# EasyEDA Pro project Watchdog.eprj

# Schematic Schematic1
Board Name: Board1; Create Date: 2025-07-15; Page Name: P1; Project Name: Watchdog; Schematic Name: Schematic1; Update Date: 2025-07-22; Company: 嘉立创EDA; Page Size: A4; Version: V1.0
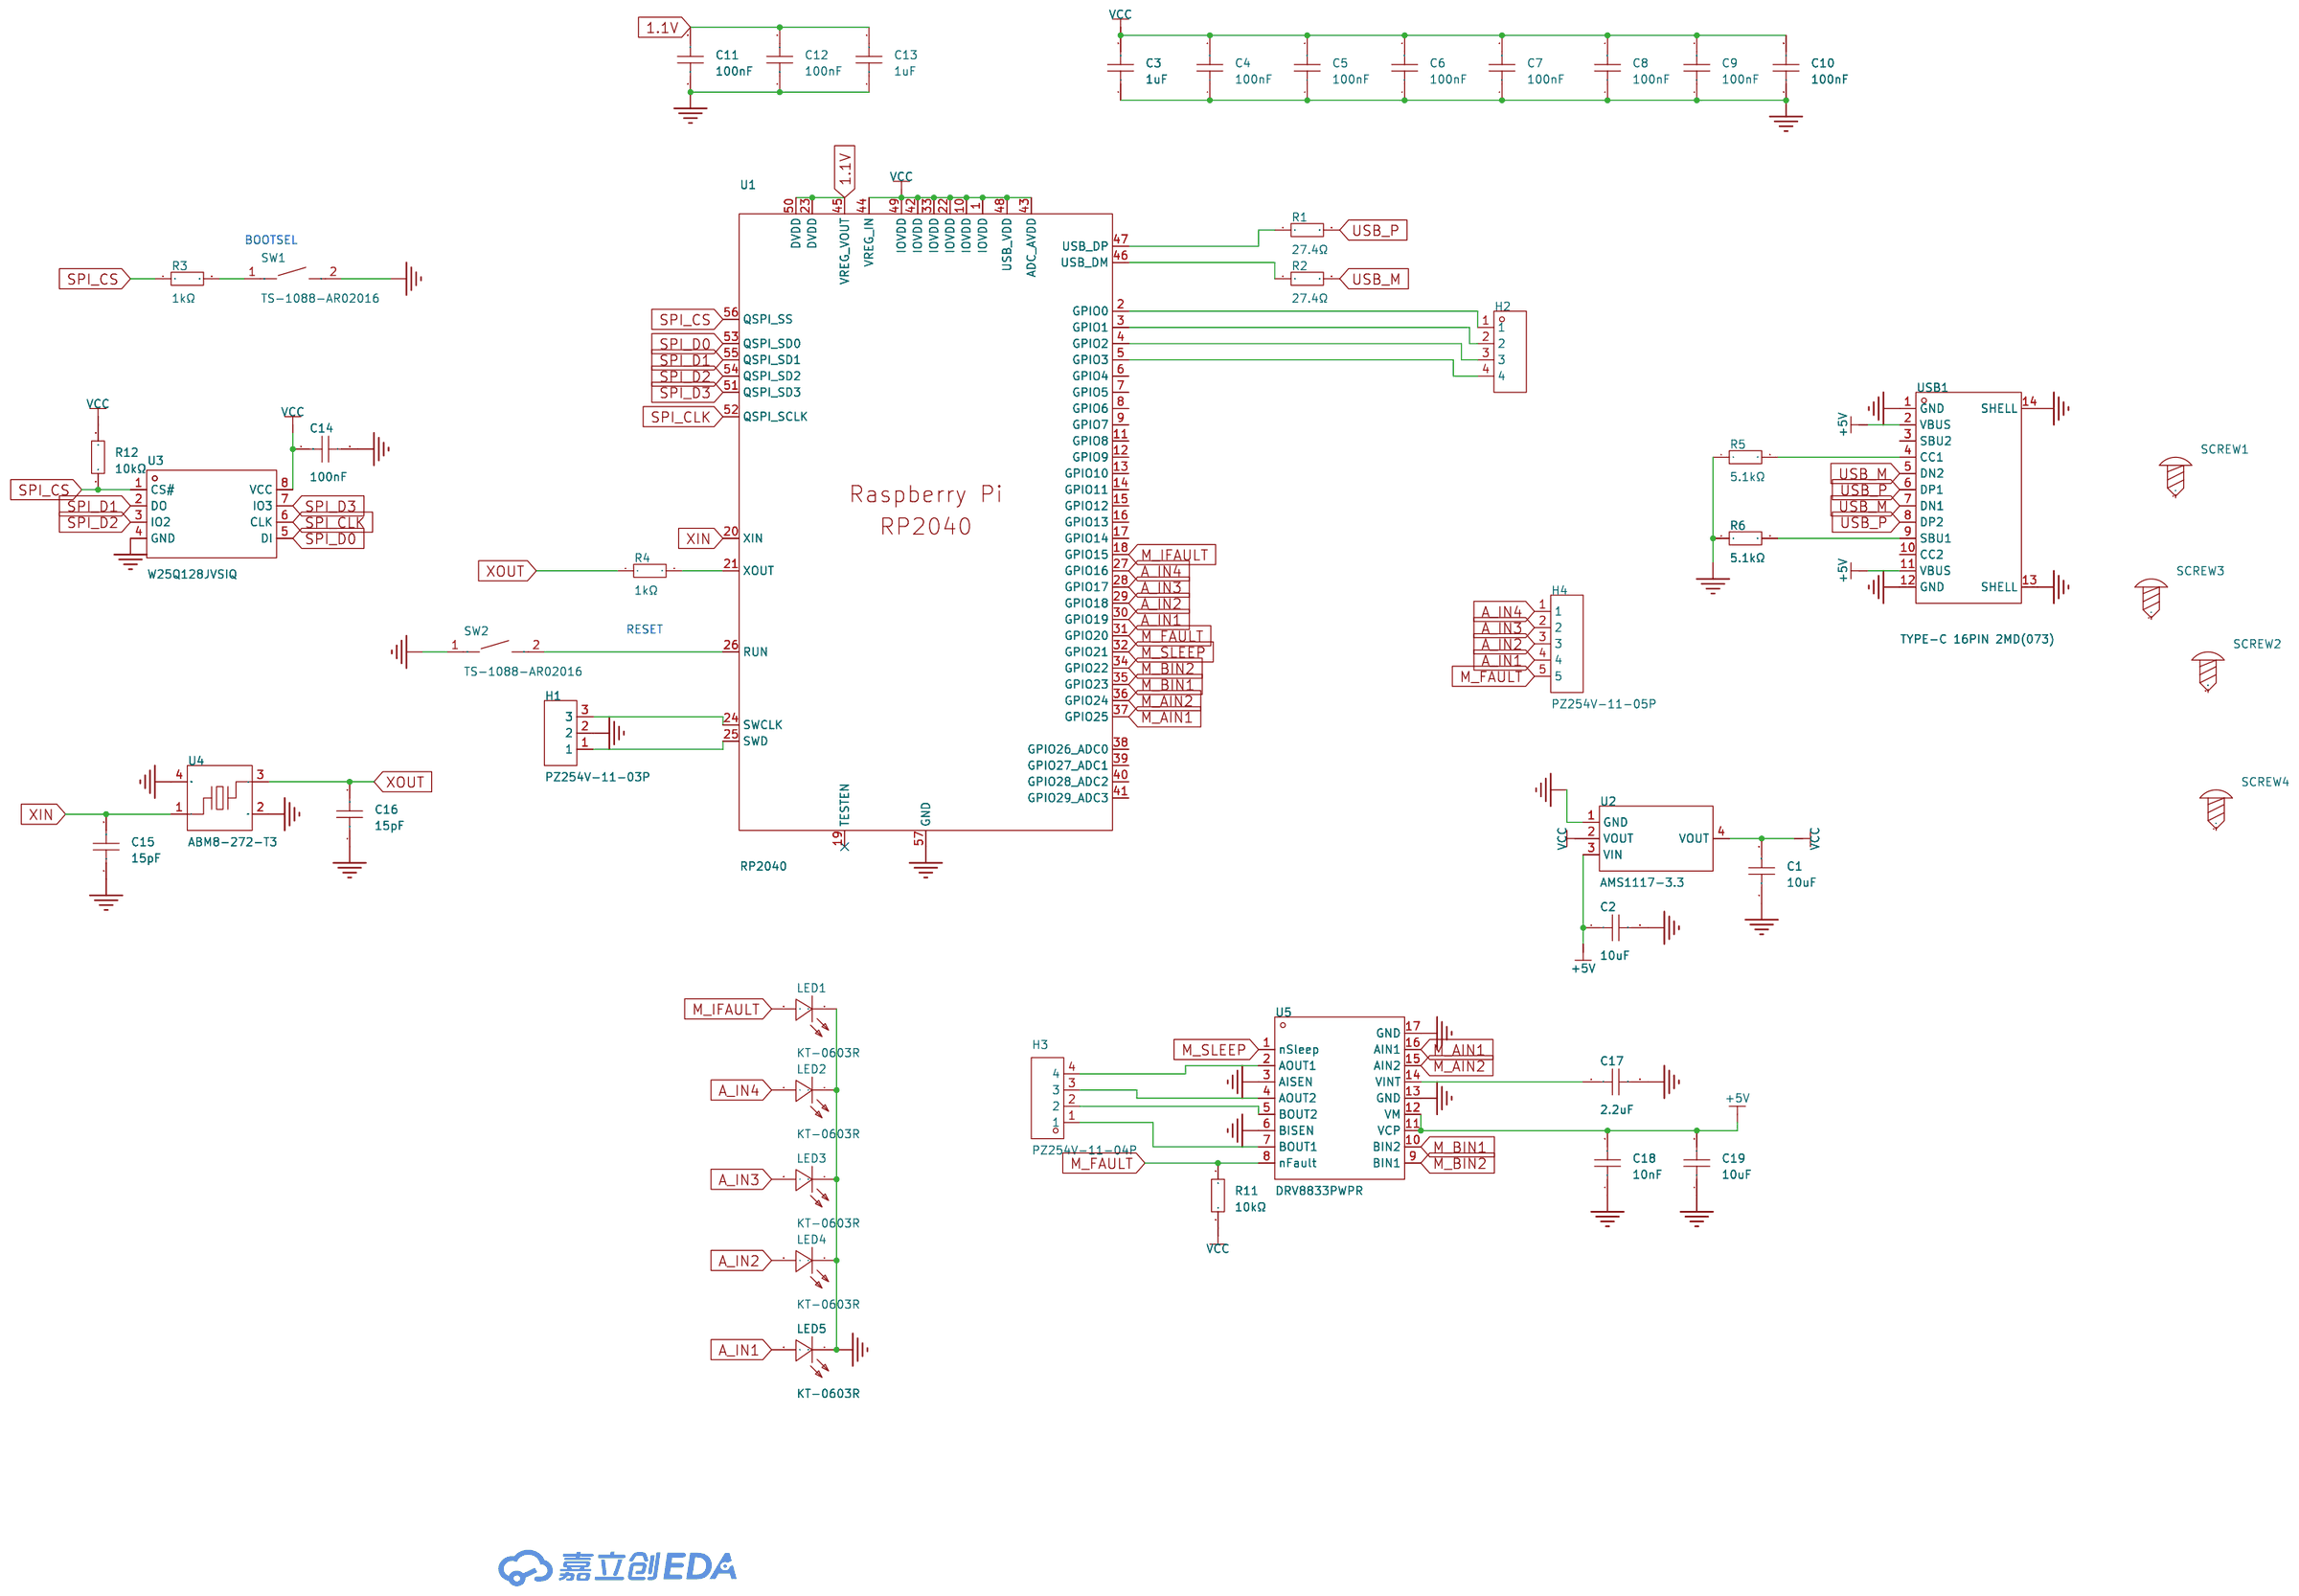
[diagram p0: schematic sheet]

## Parts
C1  10uF  [C0402]
C2  10uF  [C0402]
C3  1uF  [C0402]
C4  100nF  [C0402]
C5  100nF  [C0402]
C6  100nF  [C0402]
C7  100nF  [C0402]
C8  100nF  [C0402]
C9  100nF  [C0402]
C10  100nF  [C0402]
C11  100nF  [C0402]
C12  100nF  [C0402]
C13  1uF  [C0402]
C14  100nF  [C0402]
C15  15pF  [C0402]
C16  15pF  [C0402]
C17  2.2uF  [C0402]
C18  10nF  [C0402]
C19  10uF  [C0402]
H1  PZ254V-11-03P  [HDR-TH_3P-P2.54-V-M]
H2  PZ254V-11-04P  [HDR-TH_4P-P2.54-V-M]
H3  PZ254V-11-04P  [HDR-TH_4P-P2.54-V-M]
H4  PZ254V-11-05P  [HDR-TH_5P-P2.54-V-M]
LED1  KT-0603R  [LED0603-RD]
LED2  KT-0603R  [LED0603-RD]
LED3  KT-0603R  [LED0603-RD]
LED4  KT-0603R  [LED0603-RD]
LED5  KT-0603R  [LED0603-RD]
R1  27.4Ω  [R0402]
R2  27.4Ω  [R0402]
R3  1kΩ  [R0402]
R4  1kΩ  [R0402]
R5  5.1kΩ  [R0402]
R6  5.1kΩ  [R0402]
R11  10kΩ  [R0402]
R12  10kΩ  [R0402]
SCREW1  -  [M3螺丝]
SCREW2  -  [M3螺丝]
SCREW3  -  [M3螺丝]
SCREW4  -  [M3螺丝]
SW1  TS-1088-AR02016  [SW-SMD_L3.9-W3.0-P4.45]
SW2  TS-1088-AR02016  [SW-SMD_L3.9-W3.0-P4.45]
U1  RP2040  [LQFN-56_L7.0-W7.0-P0.4-EP]
U2  AMS1117-3.3  [SOT-223-3_L6.5-W3.4-P2.30-LS7.0-BR]
U3  W25Q128JVSIQ  [SOIC-8_L5.3-W5.3-P1.27-LS8.0-BL]
U4  ABM8-272-T3  [CRYSTAL-SMD_4P-L3.2-W2.5-BL]
U5  DRV8833PWPR  [TSSOP-16_L5.0-W4.4-P0.65-LS6.4-BL-EP]
USB1  TYPE-C 16PIN 2MD(073)  [USB-C-SMD_TYPE-C-6PIN-2MD-073]

## Library data of the parts
C1 C2 C19 = CL05A106MQ5NUNC: LCSC Part Name: 10uF ±20% 6.3V; Supplier Part: C15525; Manufacturer: SAMSUNG(三星); Supplier Footprint: 0402; JLCPCB Part Class: Basic Part; Datasheet: https://atta.szlcsc.com/upload/public/pdf/source/20220823/2B02EE04F8F211D38A52DCB16EB6BEBA.pdf; Supplier: LCSC; Tolerance: ±20%; Voltage Rated: 6.3V; Temperature Coefficient: X5R
C3 C13 = CL05A105KA5NQNC: LCSC Part Name: 1uF ±10% 25V; Supplier Part: C52923; Manufacturer: SAMSUNG(三星); Supplier Footprint: 0402; JLCPCB Part Class: Basic Part; Datasheet: https://atta.szlcsc.com/upload/public/pdf/source/20160218/1457707763339.pdf; Supplier: LCSC; Tolerance: ±10%; Voltage Rated: 25V; Temperature Coefficient: X5R
C4-C12 C14 = CL05B104KB54PNC: LCSC Part Name: 100nF ±10% 50V; Supplier Part: C307331; Manufacturer: SAMSUNG(三星); Supplier Footprint: 0402; JLCPCB Part Class: Basic Part; Datasheet: https://atta.szlcsc.com/upload/public/pdf/source/20160218/1457707763339.pdf; Supplier: LCSC; Tolerance: ±10%; Voltage Rated: 50V; Temperature Coefficient: X7R
C15 C16 = 0402CG150J500NT: LCSC Part Name: 15pF ±5% 50V; Supplier Part: C1548; Manufacturer: FH(风华); Supplier Footprint: 0402; JLCPCB Part Class: Basic Part; Datasheet: https://atta.szlcsc.com/upload/public/pdf/source/20200305/C486355_26A10D38EF8C2A5C37091D0039909270.pdf; Supplier: LCSC; Tolerance: ±5%; Voltage Rated: 50V; Temperature Coefficient: C0G
C17 = CL05A225MQ5NSNC: LCSC Part Name: 2.2uF ±20% 6.3V; Supplier Part: C12530; Manufacturer: SAMSUNG(三星); Supplier Footprint: 0402; JLCPCB Part Class: Basic Part; Datasheet: https://atta.szlcsc.com/upload/public/pdf/source/20160218/1457707763339.pdf; Supplier: LCSC; Tolerance: ±20%; Voltage Rated: 6.3V; Temperature Coefficient: X5R
C18 = CL05B103KB5NNNC: LCSC Part Name: 10nF ±10% 50V; Supplier Part: C15195; Manufacturer: SAMSUNG(三星); Supplier Footprint: 0402; JLCPCB Part Class: Basic Part; Datasheet: https://atta.szlcsc.com/upload/public/pdf/source/20160218/1457707763339.pdf; Supplier: LCSC; Tolerance: ±10%; Voltage Rated: 50V; Temperature Coefficient: X7R
H1 = PZ254V-11-03P: LCSC Part Name: 1x3P 间距:2.54mm 方针 直插; Supplier Part: C2937625; Manufacturer: XFCN(兴飞); Supplier Footprint: 插件,P=2.54mm; JLCPCB Part Class: 扩展库; Datasheet: https://atta.szlcsc.com/upload/public/pdf/source/20200309/C492402_8335C3D49C4E4C618838D59BB1D024C1.pdf; Supplier: LCSC; Pin Structure: 1x3P; Pitch: 2.54mm; Circluar Pins/Square Pins: 方针; Mounting Type: 直插; Number of Rows: 单排; Number of Pins: 3P; Current Rating: 3A; Voltage Rating (Max): 250V; Length of Mating Pin: 6mm; Insulation Height: 2.5mm; Length of End Connection Pin: 3mm; Operating Temperature: -40℃~+105℃; Color: 黑色
H2 H3 = PZ254V-11-04P: LCSC Part Name: 间距:2.54mm 1x4P 直插 方针; Supplier Part: C2691448; Manufacturer: XFCN(兴飞); Supplier Footprint: 插件,P=2.54mm; JLCPCB Part Class: 扩展库; Datasheet: https://atta.szlcsc.com/upload/public/pdf/source/20200309/C492403_F9F19131791D08044AD4F84F8E751A34.pdf; Supplier: LCSC; Pin Structure: 1x4P; Pitch: 2.54mm; Circluar Pins/Square Pins: 方针; Mounting Type: 直插; Number of Rows: 单排; Number of Pins: 4P; Current Rating (Max): 3A; Voltage Rating (Max): 250V; Length of Mating Pin: 6mm; Insulation Height: 2.5mm; Length of End Connection Pin: 3mm; Operating Temperature Range: -40℃~+105℃; Color: 黑色
H4 = PZ254V-11-05P: LCSC Part Name: 1x5P 间距:2.54mm 方针 直插; Supplier Part: C492404; Manufacturer: XFCN(兴飞); Supplier Footprint: 插件,P=2.54mm; JLCPCB Part Class: 扩展库; Datasheet: https://atta.szlcsc.com/upload/public/pdf/source/20200309/C492404_E51533260F8710EFF5D4617281164C1D.pdf; Supplier: LCSC; Pin Structure: 1x5P; Pitch: 2.54mm; Circluar Pins/Square Pins: 方针; Mounting Type: 直插; Number of Rows: 单排; Number of Pins: 5P; Length of Mating Pin: 6mm; Insulation Height: 2.5mm; Length of End Connection Pin: 3mm; Contact Material: 黄铜; Operating Temperature: -40℃~+105℃; Color: 黑色
LED1-LED5 = KT-0603R: LCSC Part Name: 0603 红灯 高亮; Supplier Part: C2286; Manufacturer: KENTO; Supplier Footprint: 0603; JLCPCB Part Class: 基础库; Datasheet: https://atta.szlcsc.com/upload/public/pdf/source/20160616/1466072038404.pdf; Supplier: LCSC; Emitted Color: 红色; Operating Temperature: -40℃~+85℃
R1 R2 = WR04X27R4FTL: LCSC Part Name: 厚膜电阻 27.4Ω ±1% 62.5mW; Supplier Part: C172043; Manufacturer: Walsin(华新科); Supplier Footprint: 0402; JLCPCB Part Class: Extended Part; Datasheet: https://atta.szlcsc.com/upload/public/pdf/source/20191217/C470037_D99261402F77DA8B1D609223749D445A.pdf; Supplier: LCSC; Type: 厚膜电阻; Tolerance: ±1%; Power(Watts): 62.5mW; Overload Voltage (Max): 50V; Temperature Coefficient: ±100ppm/℃; Operating Temperature Range: -55℃~+155℃
R3 R4 = 0402WGF1001TCE: LCSC Part Name: 1kΩ ±1% 62.5mW 厚膜电阻; Supplier Part: C11702; Manufacturer: UNI-ROYAL(厚声); Supplier Footprint: 0402; JLCPCB Part Class: Basic Part; Datasheet: https://atta.szlcsc.com/upload/public/pdf/source/20200306/C422600_1E6D84923E4A46A82E41ADD87F860B5C.pdf; Supplier: LCSC; Type: 厚膜电阻; Tolerance: ±1%; Power(Watts): 62.5mW; Overload Voltage (Max): 50V; Temperature Coefficient: ±100ppm/℃; Operating Temperature Range: -55℃~+155℃
R5 R6 = 0402WGF5101TCE: LCSC Part Name: 5.1kΩ ±1% 62.5mW 厚膜电阻; Supplier Part: C25905; Manufacturer: UNI-ROYAL(厚声); Supplier Footprint: 0402; JLCPCB Part Class: Basic Part; Datasheet: https://atta.szlcsc.com/upload/public/pdf/source/20200306/C422600_1E6D84923E4A46A82E41ADD87F860B5C.pdf; Supplier: LCSC; Type: 厚膜电阻; Tolerance: ±1%; Power(Watts): 62.5mW; Overload Voltage (Max): 50V; Temperature Coefficient: ±100ppm/℃; Operating Temperature Range: -55℃~+155℃
R11 R12 = 0402WGF1002TCE: LCSC Part Name: 10kΩ ±1% 62.5mW 厚膜电阻; Supplier Part: C25744; Manufacturer: UNI-ROYAL(厚声); Supplier Footprint: 0402; JLCPCB Part Class: Basic Part; Datasheet: https://atta.szlcsc.com/upload/public/pdf/source/20200306/C422600_1E6D84923E4A46A82E41ADD87F860B5C.pdf; Supplier: LCSC; Type: 厚膜电阻; Tolerance: ±1%; Power(Watts): 62.5mW; Overload Voltage (Max): 50V; Temperature Coefficient: ±100ppm/℃; Operating Temperature Range: -55℃~+155℃
SCREW1-SCREW4 = M3螺丝: Supplier Footprint: 插件
SW1 SW2 = TS-1088-AR02016: 电路结构:单刀单掷;按钮形状:圆形按钮;作用力:160gf;安装方式:立贴;开关长度:4mm;开关宽度:3mm;开关高度:2mm;带支架:不带;触点电流:50mA;额定电压(DC):12V;绝缘电阻:100MΩ;机械寿命:10万次;; LCSC Part Name: 4*3*2mm 立贴 轻触开关; Supplier Part: C720477; Manufacturer: XUNPU(讯普); Supplier Footprint: SMD; JLCPCB Part Class: 扩展库; Datasheet: https://atta.szlcsc.com/upload/public/pdf/source/20200810/C720475_60D09DD6C54279ADDB2DC25100F1CC11.pdf; Supplier: LCSC; Circuit: 单刀单掷; Actuator Style: 圆形按钮; Operating Force: 160gf; Mounting Style: 立贴; Switch Length: 4mm; Switch Width: 3mm; Switch Height: 2mm; Strike Gundam: 不带; Contact Current: 50mA; Voltage Rating (DC): 12V; Insulation Resistance: 100MΩ; Actuator/Cap Color: 黑色; Pin Style: SMD接片; Mechanical Life: 10万次; Operating Temperature: -30℃~+80℃
U1 = RP2040_C2040: CPU内核:-;CPU最大主频:133MHz;应用领域:-;; LCSC Part Name: RP2040（RP2B2）; Supplier Part: C2040; Manufacturer: Raspberry Pi(树莓派); Supplier Footprint: LQFN-56(7x7); JLCPCB Part Class: 扩展库; Datasheet: https://atta.szlcsc.com/upload/public/pdf/source/20210621/C2040_96F425825606B7957D87DD32E2512CA9.pdf; Supplier: LCSC; CPU Maximum Speed: 133MHz; Number of I/O: 30; ADC (Bit): 12bit
U2 = AMS1117-3.3_C6186: LCSC Part Name: 输出3.3V 1A; Supplier Part: C6186; Manufacturer: AMS; Supplier Footprint: SOT-223; JLCPCB Part Class: 基础库; Datasheet: https://atta.szlcsc.com/upload/public/pdf/source/20180727/C6186_7A095716F0823C02F1997A905E26C086.pdf; Supplier: LCSC; Output Type: 固定; Voltage - Supply: 16V; Output Voltage: 3.3V; Output Current: 1A; Power Supply Rejection Ratio (PSRR): 72dB@(120Hz); Voltage Dropout: 1.1V@(800mA); standby current: 5mA; Features: 过流保护；过热保护; Operating Temperature: -40℃~+125℃; Output Configuration: 正极; Number of Outputs: 1
U3 = W25Q128JVSIQ: LCSC Part Name: W25Q128JVSIQ 编带; Supplier Part: C97521; Manufacturer: WINBOND(华邦); Supplier Footprint: SOIC-8-208mil; JLCPCB Part Class: 基础库; Datasheet: https://atta.szlcsc.com/upload/public/pdf/source/20170316/1489627409956.pdf; Supplier: LCSC; Interface Type: SPI; Memory Size: 128Mbit; Clock Frequency (fc): 133MHz; Supply Voltage: 2.7V~3.6V; Page Programming Time (Tpp): 700us; Block Erase Time (tBE): 120ms@(32KB); Data Retention - TDR (Year): 20年; Operating Temperature: -40℃~+85℃
U4 = ABM8-272-T3_C20625731: 推荐配套使用产品C20625731    ABM8-272-T3 与 C2040   RP2040; Supplier Part: C20625731; Manufacturer: ABRACON; Supplier Footprint: SMD3225-4P; JLCPCB Part Class: 扩展库; Datasheet: https://atta.szlcsc.com/upload/public/pdf/source/20240227/A8BE43F636D80F75C9AF5C59EDF21E9A.pdf; Supplier: LCSC
U5 = DRV8833PWPR: LCSC Part Name: 1.5A 有刷直流电机驱动芯片 10.8V; Supplier Part: C50506; Manufacturer: TI(德州仪器); Supplier Footprint: TSSOP-16-EP; JLCPCB Part Class: 扩展库; Datasheet: https://www.ti.com/cn/lit/gpn/drv8833; Supplier: LCSC; Technology: 是; Operating Temperature: -40℃~+85℃
USB1 = TYPE-C 16PIN 2MD(073): 连接器类型:Type-C;标准:USB 3.1;公母:母;安装方式:卧贴;触点数量:16P;端口数量:1;额定电流 - 电源:5A;工作温度范围:-25℃~+85℃;; LCSC Part Name: Type-C 母 卧贴; Supplier Part: C2765186; Manufacturer: SHOU HAN(首韩); Supplier Footprint: SMD; JLCPCB Part Class: 扩展库; Datasheet: https://atta.szlcsc.com/upload/public/pdf/source/20211123/39B17C16241EAC15C5E277BDA434118E.pdf; Supplier: LCSC; Connector Type: Type-C; Standard: USB 3.1; Gender: 母; Mounting Style: 卧贴; Number of Contacts: 16P; Number of Ports: 1; Current Rating - Power (Max): 5A; Operating Temperature Range: -25℃~+85℃; Rated Voltage (Max): 5V; Connect-Disconnect Life: 5千次; Core Colour: 黑色

## Nets
1.1V: C11.2 C12.2 C13.2 U1.23(DVDD) U1.45(VREG_VOUT) U1.50(DVDD)
+5V: C2.1 C18.2 C19.2 U2.3(VIN) U5.11(VCP) U5.12(VM) USB1.2(VBUS) USB1.11(VBUS)
GND: C1.1 C2.2 C3.1 C4.1 C5.1 C6.1 C7.1 C8.1 C9.1 C10.1 C11.1 C12.1 C13.1 C14.2 C15.1 C16.1 C17.2 C18.1 C19.1 H1.2 LED1.1(K) LED2.1(K) LED3.1(K) LED4.1(K) LED5.1(K) R5.1 R6.1 SW1.2 SW2.1 U1.57(GND) U2.1(GND) U3.4(GND) U4.2(GND) U4.4(GND) U5.3(AISEN) U5.6(BISEN) U5.13(GND) U5.17(GND) USB1.1(GND) USB1.12(GND) USB1.13(SHELL) USB1.14(SHELL)
VCC: C1.2 C3.2 C4.2 C5.2 C6.2 C7.2 C8.2 C9.2 C10.2 C14.1 R11.1 R12.2 U1.1(IOVDD) U1.10(IOVDD) U1.22(IOVDD) U1.33(IOVDD) U1.42(IOVDD) U1.43(ADC_AVDD) U1.44(VREG_IN) U1.48(USB_VDD) U1.49(IOVDD) U2.2(VOUT) U2.4(VOUT) U3.8(VCC)
A_IN1: H4.4 LED5.2(A) U1.30(GPIO19)
A_IN2: H4.3 LED4.2(A) U1.29(GPIO18)
A_IN3: H4.2 LED3.2(A) U1.28(GPIO17)
A_IN4: H4.1 LED2.2(A) U1.27(GPIO16)
M_AIN1: U1.37(GPIO25) U5.16(AIN1)
M_AIN2: U1.36(GPIO24) U5.15(AIN2)
M_BIN1: U1.35(GPIO23) U5.10(BIN2)
M_BIN2: U1.34(GPIO22) U5.9(BIN1)
M_FAULT: H4.5 R11.2 U1.31(GPIO20) U5.8(nFault)
M_IFAULT: LED1.2(A) U1.18(GPIO15)
M_SLEEP: U1.32(GPIO21) U5.1(nSleep)
SPI_CLK: U1.52(QSPI_SCLK) U3.6(CLK)
SPI_CS: R3.1 R12.1 U1.56(QSPI_SS) U3.1(CS#)
SPI_D0: U1.53(QSPI_SD0) U3.5(DI)
SPI_D1: U1.55(QSPI_SD1) U3.2(DO)
SPI_D2: U1.54(QSPI_SD2) U3.3(IO2)
SPI_D3: U1.51(QSPI_SD3) U3.7(IO3)
USB_M: R2.2 USB1.5(DN2) USB1.7(DN1)
USB_P: R1.2 USB1.6(DP1) USB1.8(DP2)
XIN: C15.2 U1.20(XIN) U4.1
XOUT: C16.2 R4.1 U4.3
$1N13068: R1.1 U1.47(USB_DP)
$1N13076: R2.1 U1.46(USB_DM)
$1N13738: R3.2 SW1.1
$1N14583: R5.2 USB1.4(CC1)
$1N14587: R6.2 USB1.9(SBU1)
$1N14734: SW2.2 U1.26(RUN)
$1N14865: H1.3 U1.24(SWCLK)
$1N14870: H1.1 U1.25(SWD)
$1N15181: H2.1 U1.2(GPIO0)
$1N15186: H2.2 U1.3(GPIO1)
$1N15192: H2.3 U1.4(GPIO2)
$1N15202: H2.4 U1.5(GPIO3)
$1N15895: H3.4 U5.2(AOUT1)
$1N15901: H3.3 U5.4(AOUT2)
$1N15907: H3.2 U5.5(BOUT2)
$1N15913: H3.1 U5.7(BOUT1)
$1N15988: C17.1 U5.14(VINT)
$1N24654: R4.2 U1.21(XOUT)

Not connected (* = marked no-connect by the designer): SCREW1 1; SCREW2 1; SCREW3 1; SCREW4 1; U1 6(GPIO4) 7(GPIO5) 8(GPIO6) 9(GPIO7) 11(GPIO8) 12(GPIO9) 13(GPIO10) 14(GPIO11) 15(GPIO12) 16(GPIO13) 17(GPIO14) 19(TESTEN)* 38(GPIO26_ADC0) 39(GPIO27_ADC1) 40(GPIO28_ADC2) 41(GPIO29_ADC3); USB1 3(SBU2) 10(CC2)

## Notes on the sheet
- BOOTSEL
- RESET

# Board PCB1
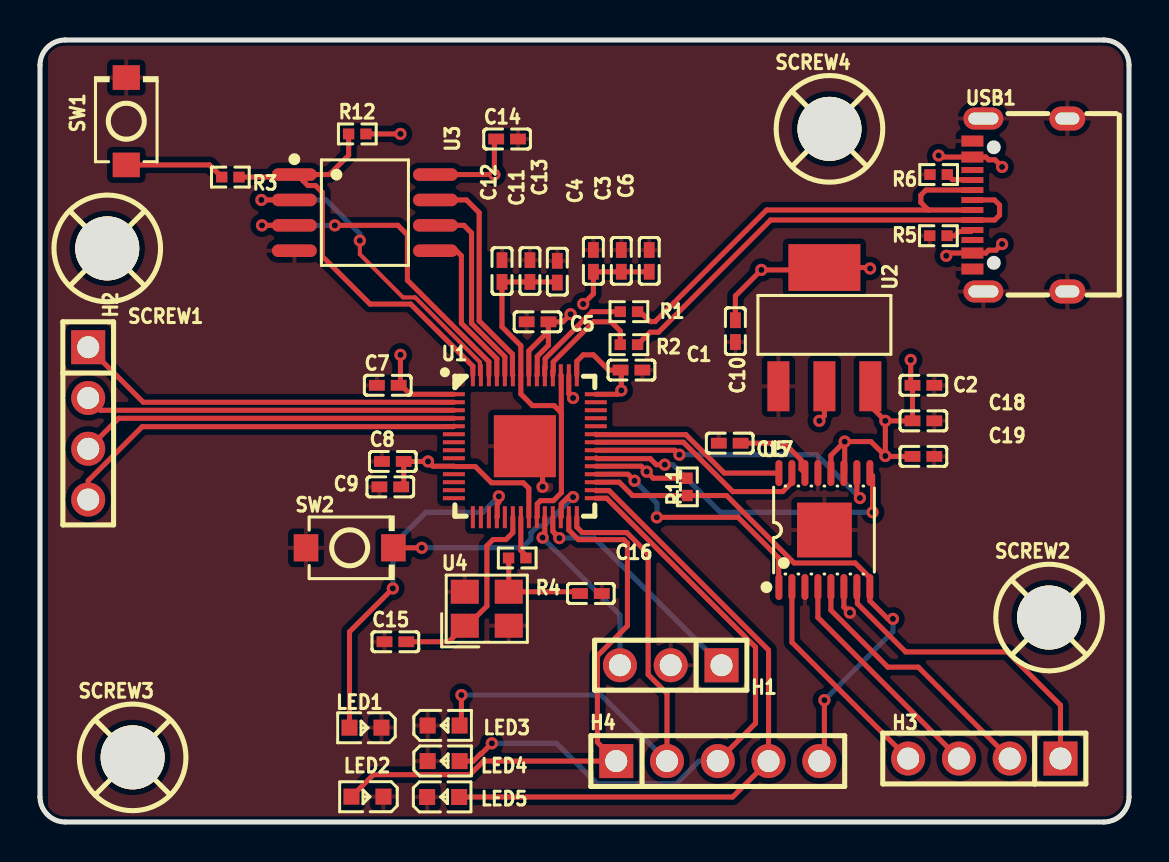
[diagram p1: board, top side]
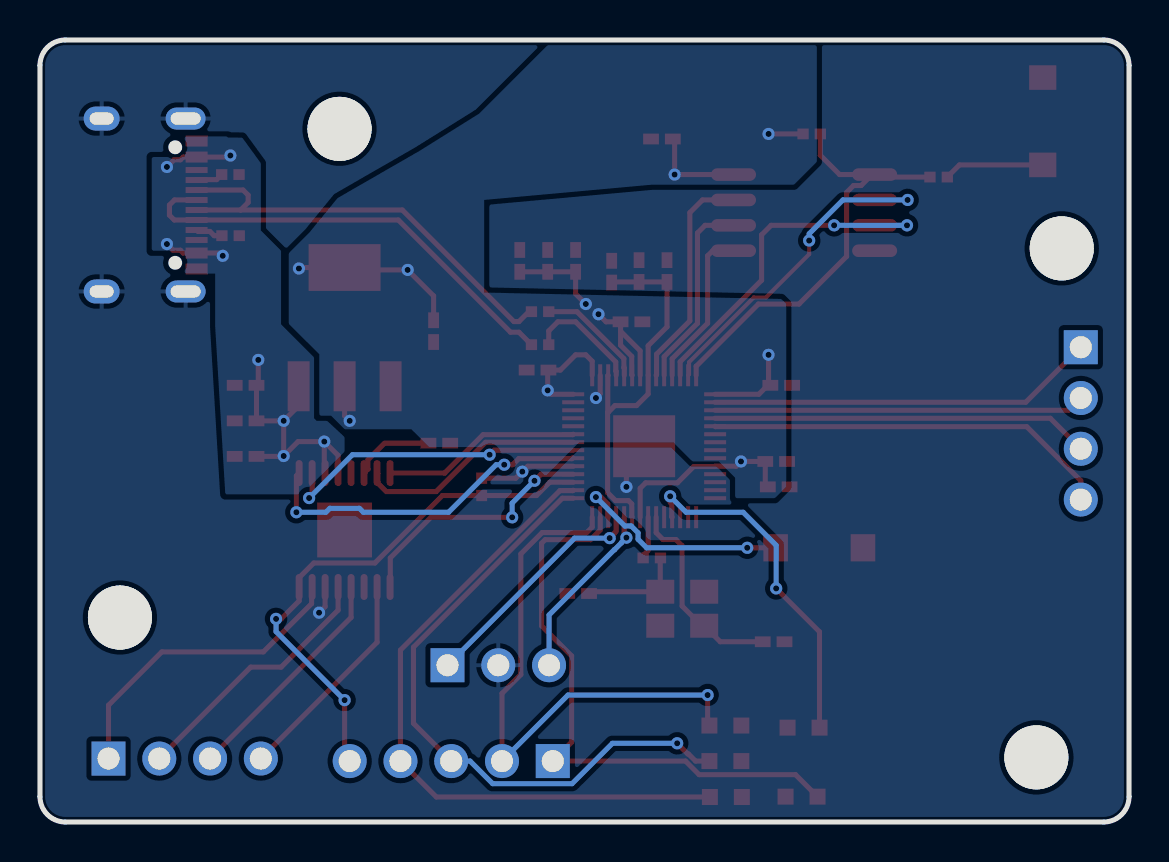
[diagram p2: board, bottom side, seen from below]

Outline 54.48 x 39.12 mm; copper layers: Top Layer, Bottom Layer. Coordinates in mm from the lower left corner of the outline.
Outline path: 0,37.85 0,1.27 arc(0.37,0.37) 1.27,0 53.21,0 arc(54.11,0.37) 54.48,1.27 54.48,37.85 arc(54.11,38.74) 53.21,39.12 1.27,39.12 arc(0.37,38.74) 0,37.85
Stack: Top Layer 0.035mm / Dielectric1 1.51mm FR4 er 4.5 / Bottom Layer 0.035mm

## Design rules (mm)
net USB_P: DP2
net $1N13068: DP1
net $1N13076: DP1
net USB_M: DP2
template: 自定义配置
spacing copperThickness1oz (default): track to track 0.102, other pairs 0.152 to 0.3
spacing copperThickness2oz: track to track 0.203, other pairs 0.152 to 0.3
track width copperThickness1oz (default): min 0.127, default 0.254, max 2.54
track width copperThickness2oz: min 0.203, default 0.254, max 2.54
differential pair differentialPair (default): width min 0.127, default 0.254, max 2.54; gap min 0.152, default 0.152
via viaSize (default): diameter min 0.406, default 0.61, max 10; hole min 0.3, default 0.305, max 6.3

## Placement (name value [footprint] x y rotation side)
C1  10uF  [C0402]  29.59 22.61 180 top
C2  10uF  [C0402]  44.2 21.84 0 top
C3  1uF  [C0402]  29.08 28.07 270 top
C4  100nF  [C0402]  27.69 28.07 270 top
C5  100nF  [C0402]  24.89 25.02 0 top
C6  100nF  [C0402]  30.48 28.07 270 top
C7  100nF  [C0402]  17.4 21.84 0 top
C8  100nF  [C0402]  17.65 18.03 0 top
C9  100nF  [C0402]  17.53 16.76 0 top
C10  100nF  [C0402]  34.79 24.55 90 top
C11  100nF  [C0402]  24.51 27.56 270 top
C12  100nF  [C0402]  23.11 27.56 270 top
C13  1uF  [C0402]  25.88 27.53 270 top
C14  100nF  [C0402]  23.37 34.16 0 top
C15  15pF  [C0402]  17.78 9.02 0 top
C16  15pF  [C0402]  27.56 11.43 180 top
C17  2.2uF  [C0402]  34.51 18.95 180 top
C18  10nF  [C0402]  44.2 20.07 180 top
C19  10uF  [C0402]  44.2 18.29 180 top
H1  PZ254V-11-03P  [HDR-TH_3P-P2.54-V-M]  31.56 7.84 180 top
H2  PZ254V-11-04P  [HDR-TH_4P-P2.54-V-M]  2.41 19.94 270 top
H3  PZ254V-11-04P  [HDR-TH_4P-P2.54-V-M]  47.24 3.17 180 top
H4  PZ254V-11-05P  [HDR-TH_5P-P2.54-V-M]  33.91 3.05 0 top
LED1  KT-0603R  [LED0603-RD]  16.28 4.72 180 top
LED2  KT-0603R  [LED0603-RD]  16.38 1.27 180 top
LED3  KT-0603R  [LED0603-RD]  20.19 4.83 0 top
LED4  KT-0603R  [LED0603-RD]  20.19 3.05 0 top
LED5  KT-0603R  [LED0603-RD]  20.17 1.25 0 top
R1  27.4Ω  [R0402]  29.46 25.53 0 top
R2  27.4Ω  [R0402]  29.46 23.88 0 top
R3  1kΩ  [R0402]  9.53 32.26 180 top
R4  1kΩ  [R0402]  23.88 13.21 0 top
R5  5.1kΩ  [R0402]  44.95 29.33 0 top
R6  5.1kΩ  [R0402]  44.96 32.38 0 top
R11  10kΩ  [R0402]  32.38 16.76 270 top
R12  10kΩ  [R0402]  15.88 34.42 0 top
SCREW1  -  [M3螺丝]  3.37 28.69 0 top
SCREW2  -  [M3螺丝]  50.48 10.23 0 top
SCREW3  -  [M3螺丝]  4.64 3.23 0 top
SCREW4  -  [M3螺丝]  39.5 34.67 0 top
SW1  TS-1088-AR02016  [SW-SMD_L3.9-W3.0-P4.45]  4.32 35.05 90 top
SW2  TS-1088-AR02016  [SW-SMD_L3.9-W3.0-P4.45]  15.49 13.72 0 top
U1  RP2040  [LQFN-56_L7.0-W7.0-P0.4-EP]  24.26 18.8 0 top
U2  AMS1117-3.3  [SOT-223-3_L6.5-W3.4-P2.30-LS7.0-BR]  39.24 24.77 270 top
U3  W25Q128JVSIQ  [SOIC-8_L5.3-W5.3-P1.27-LS8.0-BL]  16.26 30.48 270 top
U4  ABM8-272-T3  [CRYSTAL-SMD_4P-L3.2-W2.5-BL]  22.35 10.67 0 top
U5  DRV8833PWPR  [TSSOP-16_L5.0-W4.4-P0.65-LS6.4-BL-EP]  39.24 14.6 0 top
USB1  TYPE-C 16PIN 2MD(073)  [USB-C-SMD_TYPE-C-6PIN-2MD-073]  49.02 30.86 90 top

## Footprints (pads in the part's own frame, mm; a bottom-side part is the same pattern mirrored in y, then rotated)
C0402
  rect 0.79x0.54 smd: 1(-0.545,0) 2(0.545,0)
CRYSTAL-SMD_4P-L3.2-W2.5-BL
  rect 1.4x1.2 smd: 1(-1.1,-0.85) 2(1.1,-0.85) 3(1.1,0.85) 4(-1.1,0.85)
HDR-TH_3P-P2.54-V-M
  rect 1.7x1.7 hole 1.1: 1(-2.54,0)
  round 1.7 hole 1.1: 2(0,0) 3(2.54,0)
HDR-TH_4P-P2.54-V-M
  rect 1.7x1.7 hole 1.1: 1(-3.81,0)
  round 1.7 hole 1.1: 2(-1.27,0) 3(1.27,0) 4(3.81,0)
HDR-TH_5P-P2.54-V-M
  rect 1.7x1.7 hole 1.1: 1(-5.08,0)
  round 1.7 hole 1.1: 2(-2.54,0) 3(0,0) 4(2.54,0) 5(5.08,0)
LED0603-RD
  rect 0.8x0.8 smd: 1(-0.799,0) 2(0.799,0)
LQFN-56_L7.0-W7.0-P0.4-EP
  rect 1.1x0.2 smd: 1(-3.55,2.6) 2(-3.55,2.2) 3(-3.55,1.8) 4(-3.55,1.4) 5(-3.55,1) 6(-3.55,0.6) 7(-3.55,0.2) 8(-3.55,-0.2) 9(-3.55,-0.6) 10(-3.55,-1) 11(-3.55,-1.4) 12(-3.55,-1.8) 13(-3.55,-2.2) 14(-3.55,-2.6) 29(3.55,-2.6) 30(3.55,-2.2) 31(3.55,-1.8) 32(3.55,-1.4) 33(3.55,-1) 34(3.55,-0.6) 35(3.55,-0.2) 36(3.55,0.2) 37(3.55,0.6) 38(3.55,1) 39(3.55,1.4) 40(3.55,1.8) 41(3.55,2.2) 42(3.55,2.6)
  rect 0.2x1.1 smd: 15(-2.6,-3.55) 16(-2.2,-3.55) 17(-1.8,-3.55) 18(-1.4,-3.55) 19(-1,-3.55) 20(-0.6,-3.55) 21(-0.2,-3.55) 22(0.2,-3.55) 23(0.6,-3.55) 24(1,-3.55) 25(1.4,-3.55) 26(1.8,-3.55) 27(2.2,-3.55) 28(2.6,-3.55) 43(2.6,3.55) 44(2.2,3.55) 45(1.8,3.55) 46(1.4,3.55) 47(1,3.55) 48(0.6,3.55) 49(0.2,3.55) 50(-0.2,3.55) 51(-0.6,3.55) 52(-1,3.55) 53(-1.4,3.55) 54(-1.8,3.55) 55(-2.2,3.55) 56(-2.6,3.55)
  rect 3.1x3.1 smd: 57(0,0)
M3螺丝
  round 3.2 hole 3.2: 1(0,0)
R0402
  rect 0.566x0.54 smd: 1(-0.433,0) 2(0.433,0)
SOIC-8_L5.3-W5.3-P1.27-LS8.0-BL
  oval 0.63x2.25 smd: 1(-1.905,-3.53) 2(-0.635,-3.53) 3(0.635,-3.53) 4(1.905,-3.53) 5(1.905,3.53) 6(0.635,3.53) 7(-0.635,3.53) 8(-1.905,3.53)
SOT-223-3_L6.5-W3.4-P2.30-LS7.0-BR
  rect 2.5x1.1 smd: 1(2.97,-2.3) 2(2.97,0) 3(2.97,2.3)
  rect 2.34x3.6 smd: 4(-2.97,0)
SW-SMD_L3.9-W3.0-P4.45
  rect 1.23x1.36 smd: 1(-2.185,0) 2(2.185,0)
TSSOP-16_L5.0-W4.4-P0.65-LS6.4-BL-EP
  oval 0.35x1.3 smd: 1(-2.275,-2.85) 2(-1.625,-2.85) 3(-0.975,-2.85) 4(-0.325,-2.85) 5(0.325,-2.85) 6(0.975,-2.85) 7(1.625,-2.85) 8(2.275,-2.85) 9(2.275,2.85) 10(1.625,2.85) 11(0.975,2.85) 12(0.325,2.85) 13(-0.325,2.85) 14(-0.975,2.85) 15(-1.625,2.85) 16(-2.275,2.85)
  rect 2.74x2.74 smd: 17(0,0)
USB-C-SMD_TYPE-C-6PIN-2MD-073
  rect 0.55x1.1 smd: 1(-3.2,2.375) 2(-2.4,2.375) 11(2.4,2.375) 12(3.2,2.375)
  rect 0.3x1.1 smd: 3(-1.75,2.375) 4(-1.25,2.375) 5(-0.75,2.375) 6(-0.25,2.375) 7(0.25,2.375) 8(0.75,2.375) 9(1.25,2.375) 10(1.75,2.375)
  oval 1.1x2 hole 0.6x1.5: 13(-4.325,1.825) 14(4.325,1.825)
  oval 1.2x1.8 hole 0.6x1.2: 13(-4.325,-2.375) 14(4.325,-2.375)

## Nets
As in the schematic.

Pads without a net: SCREW1 1; SCREW2 1; SCREW3 1; SCREW4 1; U1 6 7 8 9 11 12 13 14 15 16 17 19 38 39 40 41; USB1 3 10

## Via types
v1: diameter 0.61, hole 0.305, Top Layer to Bottom Layer, 42 vias

## Routing (per net, layer and track width the routed paths; a pad name or vN(x,y) marks a point on that pad's centre or on a via; arc(x,y) is an arc through that point)
1.1V: length 19.2
  Top Layer w0.254: C13.2 25.85,27.01 C11.2 C12.2 23.11,24.77 24.06,23.82 U1.50 24.06,21.41 24.64,20.83 25.72,20.83 26.06,20.49 ; 26.06,20.49 26.08,20.51 26.08,22.32 U1.45 ; 26.06,20.49 26.09,20.46 26.09,16.47 25.69,16.07 25.04,16.07 24.88,15.91 24.88,15.27 U1.23
+5V: length 21.8
  Top Layer w0.254: v1(40.26,19.03) 41.57,19.03 v1(42.29,18.31) ; v1(40.26,19.03) 39.57,18.34 U5.12 ; v1(40.26,19.03) 40.26,17.5 U5.11 ; v1(42.29,18.31) 42.31,18.29 C19.2 ; v1(42.29,18.31) v1(42.29,20.07) ; U2.3 41.54,20.81 v1(42.29,20.07) ; v1(48.13,28.91) 47.82,28.6 47.46,28.6 47.32,28.46 USB1.2 45.48,28.46 v1(45.34,28.32) ; v1(43.56,23.11) 43.56,21.93 C2.1 C18.2 v1(42.29,20.07) ; v1(48.13,32.77) 47.78,33.12 47.46,33.12 47.32,33.26 USB1.11 45.03,33.26 v1(44.96,33.34)
GND: length 3.8
  Top Layer w0.254: v1(25.15,16.76) 25.15,17.91 U1.57 ; v1(40.52,10.47) 40.22,10.77 U5.6
VCC: length 54
  Top Layer w0.254: v1(26.54,25.4) 26.16,25.02 C5.2 25.44,24.55 ; 25.44,24.55 25.44,23.85 24.88,23.29 24.88,22.37 U1.48 ; 25.44,24.55 24.46,23.57 U1.49 ; U1.44 26.46,21.42 v1(26.67,21.21) ; C10.2 34.79,26.32 v1(36.09,27.61) 39.12,27.61 U2.4 41.48,27.73 v1(41.53,27.69) ; 27.81,21.4 28.89,21.4 v1(29.08,21.59) 29.08,22.57 C1.2 28.45,22.61 27.69,23.37 27.18,23.37 26.86,23.05 U1.43 ; U1.33 30.08,17.8 v1(30.35,17.53) 30.68,17.2 R11.1 ; 20.71,21.4 18.52,21.4 18.03,21.88 v1(18.03,23.37) ; C14.1 22.73,34.07 v1(22.73,32.38) U3.8 ; v1(27.18,25.91) 27.69,26.42 C4.2 C3.2 C6.2 ; v1(18.03,34.42) R12.2 ; U1.22 24.46,16.69 24.18,16.97 22.59,16.97 21.78,17.78 20.72,17.78 U1.10 19.65,17.8 v1(19.41,18.03) 18.2,18.03 18.2,16.89 C9.2 ; v1(38.99,20.07) 39.24,20.32 U2.2
A_IN1: length 33.7
  Top Layer w0.254: LED5.2 34.65,1.25 H4.4 36.45,8.6 28.47,16.57 27.83,16.57 U1.30
A_IN2: length 32.1
  Top Layer w0.254: H4.3 35.8,4.94 35.8,8.75 28.35,16.2 U1.29 ; v1(22.61,3.94) 22.07,3.4 22.04,3.4 21.68,3.05 LED4.2
  Bottom Layer w0.254: v1(22.61,3.94) 25.85,3.94 27.86,1.92 31.84,1.92 32.97,3.05 H4.3
A_IN3: length 28.6
  Top Layer w0.254: LED3.2 21.08,4.92 v1(21.08,6.35) ; U1.28 26.86,14.75 27.13,14.48 29.36,14.48 30.43,13.41 30.43,7.37 31.37,6.43 H4.2
  Bottom Layer w0.254: H4.2 28.07,6.35 v1(21.08,6.35)
A_IN4: length 29.7
  Top Layer w0.254: LED2.2 16.68,2.37 21.51,2.37 22.19,3.05 H4.1 27.89,3.99 27.89,8.31 29.39,9.81 29.39,13.94 29.21,14.12 26.94,14.12 26.46,14.6 U1.27
M_AIN1: length 10
  Top Layer w0.254: U5.16 34.23,17.45 32.31,19.38 27.83,19.38 27.81,19.4
M_AIN2: length 11.5
  Top Layer w0.254: U1.36 32.19,19 34.66,16.53 37.16,16.53 37.59,16.96 37.59,17.43 U5.15
M_BIN1: length 15.5
  Top Layer w0.254: U1.35 31.76,18.6 v1(31.99,18.37) ; U5.10 40.87,16.36 v1(41.02,16.2)
  Bottom Layer w0.254: v1(41.02,16.2) 38.85,18.37 v1(31.99,18.37)
M_BIN2: length 17.1
  Top Layer w0.254: 27.83,18.22 27.87,18.17 30.53,18.17 30.83,17.87 v1(31.26,17.87) ; v1(41.66,15.49) 41.66,17.32 U5.9
  Bottom Layer w0.254: v1(31.26,17.87) 31.66,17.87 34.04,15.49 38.31,15.49 38.5,15.69 39.99,15.69 40.18,15.49 v1(41.66,15.49)
M_FAULT: length 27
  Top Layer w0.254: v1(42.67,10.16) 42.42,10.16 41.52,11.06 U5.8 41.52,12.22 40.78,12.96 37.73,12.96 34.35,16.33 R11.2 29.64,16.33 28.98,17 U1.31 ; H4.5 39.24,3.3 v1(39.24,6.1)
  Bottom Layer w0.254: v1(39.24,6.1) 42.67,9.52 v1(42.67,10.16)
M_IFAULT: length 17.4
  Top Layer w0.254: v1(17.65,11.68) 15.48,9.52 LED1.2 ; U1.18 22.88,15.27 22.88,15.91 22.96,15.99 v1(22.96,16.29)
  Bottom Layer w0.254: v1(22.96,16.29) 22.16,15.49 19.3,15.49 17.65,13.84 v1(17.65,11.68)
M_SLEEP: length 12.8
  Top Layer w0.254: v1(29.74,17.07) 29.42,17.4 27.81,17.4 ; U5.1 36.96,11.77 36.96,13.21 34.93,15.24 v1(30.86,15.24)
  Bottom Layer w0.254: v1(30.86,15.24) 30.86,15.95 v1(29.74,17.07)
SPI_CLK: length 9.8
  Top Layer w0.254: U3.6 21.21,29.84 21.59,29.46 21.59,24.94 23.26,23.28 U1.52
SPI_CS: length 22.1
  Top Layer w0.254: R3.1 12.6,32.26 U3.1 12.85,32.38 ; 12.85,32.38 13.4,31.84 13.78,31.84 14.13,31.49 14.13,28.29 16.51,25.91 18.54,25.91 21.66,22.79 U1.56 ; 12.85,32.38 14.48,32.38 15.44,33.35 R12.1
SPI_D0: length 8.1
  Top Layer w0.254: U3.5 20.83,28.57 21.08,28.32 21.08,24.95 22.86,23.17 U1.53
SPI_D1: length 17.2
  Top Layer w0.203: U1.55 22.01,22.39 22.01,23 18.77,26.24 18.16,26.24 16,28.4 v1(16,29.08)
  Top Layer w0.254: v1(11.08,31.11) U3.2
  Bottom Layer w0.254: v1(16,29.08) 16,29.42 14.31,31.11 v1(11.08,31.11)
SPI_D2: length 17.6
  Top Layer w0.254: v1(11.11,29.84) U3.3 ; U1.54 22.46,23.02 18.38,27.1 18.38,29.37 17.91,29.84 14.99,29.84
  Bottom Layer w0.254: v1(14.75,29.84) v1(11.11,29.84)
SPI_D3: length 11.3
  Top Layer w0.254: U3.7 21.34,31.11 21.97,30.48 21.97,25.07 23.64,23.4 23.64,22.37 U1.51
USB_M: length 22.8
  Top Layer w0.254: USB1.7 46.65,31.11 47.75,31.11 48.01,30.86 48.01,30.35 47.76,30.11 USB1.5 36.55,30.11 30.94,24.5 30.52,24.5 R2.2
USB_P: length 22.9
  Top Layer w0.254: USB1.8 44.32,31.61 44.07,31.36 44.07,30.99 44.45,30.61 ; R1.2 30.02,25.53 30.52,25.03 30.77,25.03 36.35,30.61 44.45,30.61 ; USB1.6 44.45,30.61
XIN: length 10.1
  Top Layer w0.254: C15.2 20.45,9.02 U4.1 21.37,9.82 22.36,10.8 22.36,13.82 22.67,14.13 23.31,14.13 23.66,14.47 U1.20
XOUT: length 5.5
  Top Layer w0.254: 27.01,11.3 26.8,11.52 U4.3 23.45,13.33 23.44,13.33
$1N13068: length 5.6
  Top Layer w0.254: R1.1 27.62,25.53 25.27,23.18 25.27,22.73 25.25,22.71 25.25,22.35
$1N13076: length 5.7
  Top Layer w0.254: U1.46 25.66,22.54 25.68,22.56 25.68,23.01 27.69,25.02 28.57,25.02 29.03,24.56 R2.1
$1N13738: length 5
  Top Layer w0.254: R3.2 8.48,32.87 SW1.1
$1N14583: length 1.4
  Top Layer w0.254: R5.2 45.77,29.33 45.98,29.54 46.58,29.54 USB1.4
$1N14587: length 1.4
  Top Layer w0.254: USB1.9 46.63,32.13 45.65,32.13 R6.2
$1N14734: length 11.6
  Top Layer w0.254: v1(19.1,13.72) SW2.2 ; v1(26.67,16.25) 26.42,16.25 26.08,15.91 26.08,15.27 U1.26
  Bottom Layer w0.254: v1(26.67,16.25) 25.22,14.81 24.9,14.81 24.56,14.47 24.56,14.14 24.13,13.72 v1(19.1,13.72)
$1N14865: length 9.1
  Top Layer w0.254: v1(25.15,14.22) 25.26,14.33 U1.24
  Bottom Layer w0.254: v1(25.15,14.22) 25.4,13.97 25.4,13.96 25.74,13.62 25.75,13.62 29.02,10.35 H1.3
$1N14870: length 11.9
  Top Layer w0.254: v1(25.98,14.2) 25.73,14.45 25.73,14.47 25.66,14.54 U1.25
  Bottom Layer w0.254: H1.1 27.74,14.2 v1(25.98,14.2)
$1N15181: length 19.4
  Top Layer w0.254: U1.2 5.17,21 H2.1
$1N15186: length 18.5
  Top Layer w0.254: U1.3 3.03,20.6 H2.2
$1N15192: length 18.9
  Top Layer w0.254: U1.4 3.94,20.2 H2.3
$1N15202: length 20.4
  Top Layer w0.254: H2.4 2.41,17.07 5.12,19.77 20.69,19.77 U1.5
$1N15895: length 11
  Top Layer w0.254: U5.2 37.62,8.99 H3.4
$1N15901: length 11.5
  Top Layer w0.254: U5.4 38.92,10.23 H3.3
$1N15907: length 13.2
  Top Layer w0.254: H3.2 43.94,7.75 42.42,7.75 39.57,10.6 U5.5
$1N15913: length 15.8
  Top Layer w0.254: U5.7 40.89,11.73 40.89,10.92 43.31,8.51 48.39,8.51 51.05,5.84 H3.1
$1N15988: length 4.1
  Top Layer w0.254: C17.1 37.24,18.95 38.07,18.12 38.07,17.65 U5.14
$1N24654: length 2
  Top Layer w0.254: 24.31,13.33 24.06,13.59 U1.21

## Copper pours and planes (outline as drawn; the poured copper is in the pictures)
+5V on Bottom Layer: 48.9,28.57 47.24,28.57 47.24,27.43 45.72,27.43 45.72,24.77 45.21,16.38 39.62,16.38 39.24,16.76 39.24,19.25 40.11,20.07 40.64,20.07 40.77,20.19 40.77,23.24 42.42,24.89 42.42,28.57 43.43,29.59 43.43,32.96 44.36,34.23 45.09,34.24 45.09,34.29 47.24,34.29 47.24,33.26 48.9,33.26
GND on Top Layer: 0.38,39.24 54.86,39.24 54.86,0.13 0.38,0.13
GND on Bottom Layer: -0.13,39.12 54.61,39.12 54.61,0 -0.13,0
VCC on Bottom Layer: 32.51,35.43 35.56,33.53 39.6,31.2 41.02,29.46 42.04,28.45 42.04,24.92 40.51,23.39 40.51,20.32 39.92,20.32 39.24,19.65 35.9,19.65 33.15,16.89 29.61,16.89 27.51,19 22.81,19 21.84,18.03 20.52,18.03 19.71,17.22 19.71,16.2 17.72,16.2 17.15,16.76 17.15,25.91 17.4,26.16 32.26,26.49 32.26,31.11 23.88,31.88 16.76,31.88 15.62,33.02 15.62,38.99 28.96,38.99
